# EAGLE schematic 01-pushbutton interface (EAGLE 9.3.0)
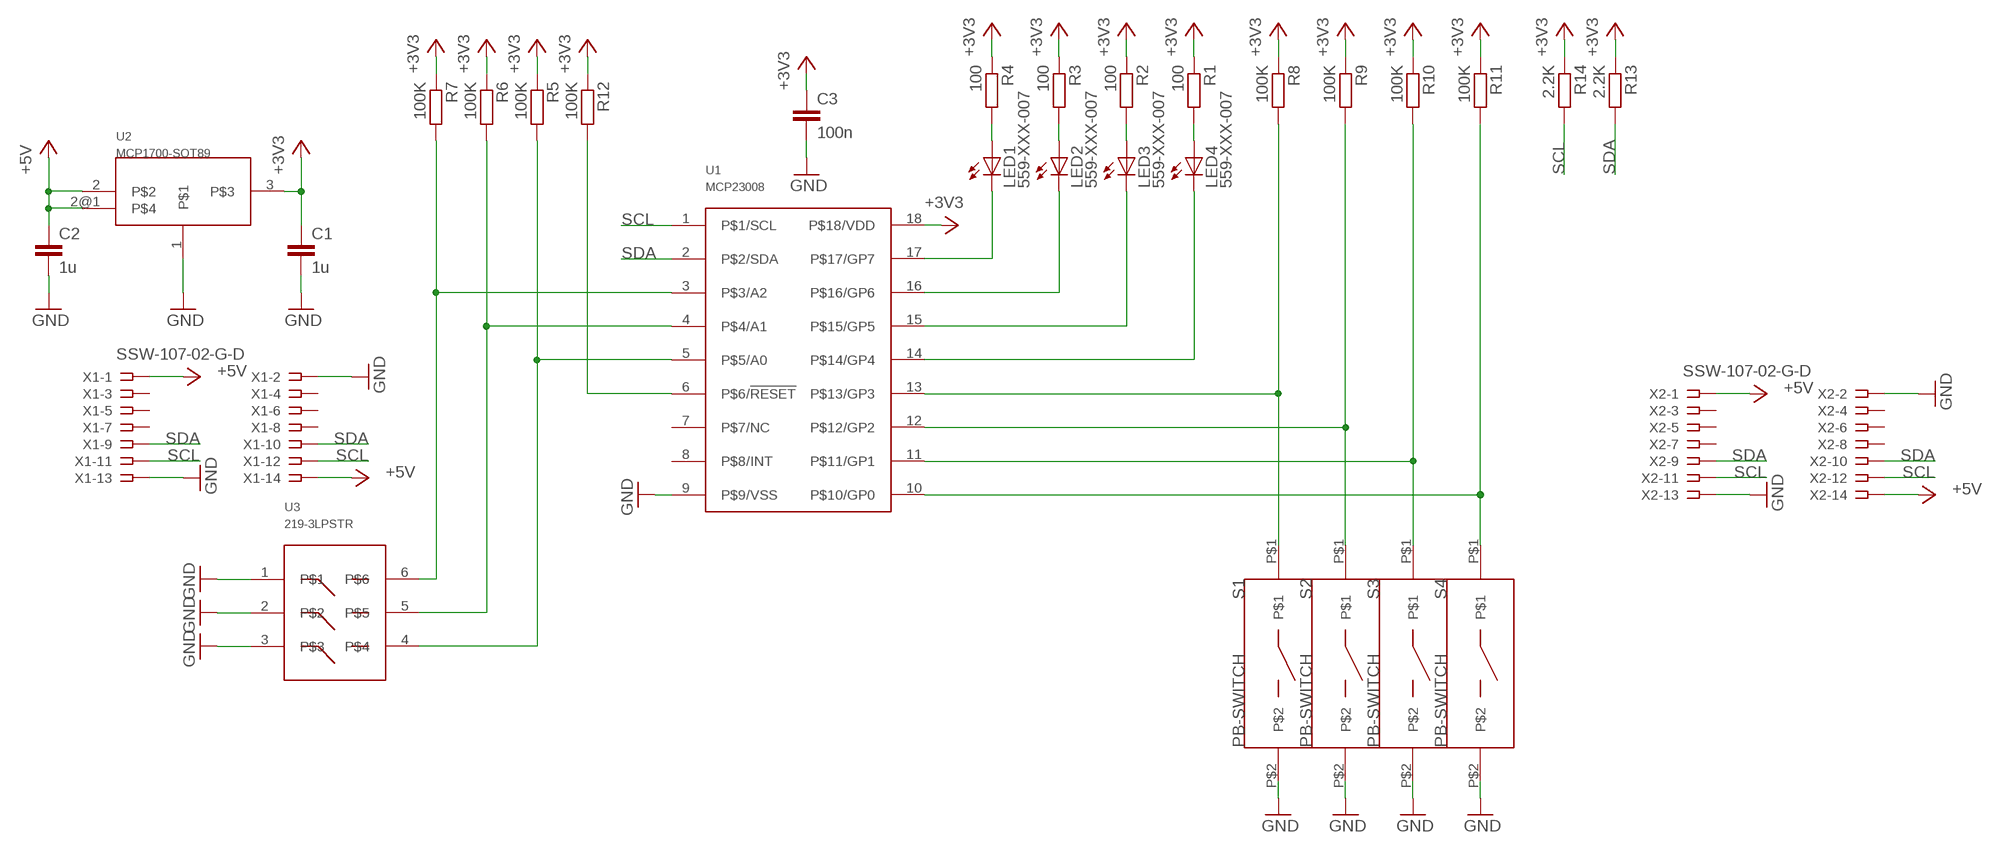
[diagram p0: schematic, sheet 1]

## Parts
C1  1u  C-EUC0805  [C0805]
C2  1u  C-EUC0805  [C0805]
C3  100n  C-EUC0805  [C0805]
LED1  559-XXX-007  [LED]
LED2  559-XXX-007  [LED]
LED3  559-XXX-007  [LED]
LED4  559-XXX-007  [LED]
R1  100  R-EU_R0805  [R0805]
R2  100  R-EU_R0805  [R0805]
R3  100  R-EU_R0805  [R0805]
R4  100  R-EU_R0805  [R0805]
R5  100K  R-EU_R0805  [R0805]
R6  100K  R-EU_R0805  [R0805]
R7  100K  R-EU_R0805  [R0805]
R8  100K  R-EU_R0805  [R0805]
R9  100K  R-EU_R0805  [R0805]
R10  100K  R-EU_R0805  [R0805]
R11  100K  R-EU_R0805  [R0805]
R12  100K  R-EU_R0805  [R0805]
R13  2.2K  R-EU_R0805  [R0805]
R14  2.2K  R-EU_R0805  [R0805]
S1  PB-SWITCH  [SWITCH]
S2  PB-SWITCH  [SWITCH]
S3  PB-SWITCH  [SWITCH]
S4  PB-SWITCH  [SWITCH]
U1  MCP23008  [MCP23008-SO18]
U2  MCP1700-SOT89  [MCP1700-SOT89]
U3  219-3LPSTR  [219-3LPSTR]
X1  SSW-107-02-G-D  [SSW-107-02-G-D]
X2  SSW-107-02-G-D  [SSW-107-02-G-D]

## Nets
+3V3: C1.1 C3.1 R1.1 R2.1 R3.1 R4.1 R5.1 R6.1 R7.1 R8.1 R9.1 R10.1 R11.1 R12.1 R13.1 R14.1 U1.18(P$18/VDD) U2.3
+5V: C2.1 U2.2 U2.2@1 X1.1 X1.14 X2.1 X2.14
GND: C1.2 C2.2 C3.2 S1.P$2 S2.P$2 S3.P$2 S4.P$2 U1.9(P$9/VSS) U2.1 U3.1 U3.2 U3.3 X1.2 X1.13 X2.2 X2.13
N$1: R8.2 S1.P$1 U1.13(P$13/GP3)
N$2: R9.2 S2.P$1 U1.12(P$12/GP2)
N$3: LED4.P$1(A) R1.2
N$4: LED3.P$1(A) R2.2
N$5: LED2.P$1(A) R3.2
N$6: LED1.P$1(A) R4.2
N$7: LED1.P$2(C) U1.17(P$17/GP7)
N$8: LED2.P$2(C) U1.16(P$16/GP6)
N$9: LED3.P$2(C) U1.15(P$15/GP5)
N$10: LED4.P$2(C) U1.14(P$14/GP4)
N$11: R7.2 U1.3(P$3/A2) U3.6
N$12: R6.2 U1.4(P$4/A1) U3.5
N$13: R5.2 U1.5(P$5/A0) U3.4
N$14: R10.2 S3.P$1 U1.11(P$11/GP1)
N$15: R11.2 S4.P$1 U1.10(P$10/GP0)
N$16: R12.2 U1.6(P$6/!RESET)
SCL: R14.2 U1.1(P$1/SCL) X1.11 X1.12 X2.11 X2.12
SDA: R13.2 U1.2(P$2/SDA) X1.9 X1.10 X2.9 X2.10
Unconnected: U1.7(P$7/NC) U1.8(P$8/INT) X1.3 X1.4 X1.5 X1.6 X1.7 X1.8 X2.3 X2.4 X2.5 X2.6 X2.7 X2.8

## Library data of the parts
C1-C3 = rcl:C-EU: CAPACITOR, European symbol; SPICEPREFIX: C
LED1-LED4 = MIDI router parts:559-XXX-007
R1-R14 = rcl:R-EU_: RESISTOR, European symbol; SPICEPREFIX: R
S1-S4 = MIDI router parts:PB-SWITCH
U1 = MIDI router parts:MCP23008
U2 = MIDI router parts:MCP1700-SOT89
U3 = MIDI router parts:219-3LPSTR
X1 X2 = MIDI router parts:SSW-107-02-G: THROUGH-HOLE .025" SQ POST SOCKET Source: Samtec SSW.pdf; MF: Samtec Inc.; MPN: SSW-107-02-G-D; OC_FARNELL: unknown; OC_NEWARK: 11P9431